# Altium schematic sheet SchemaCollier2016.SchDoc
size A4
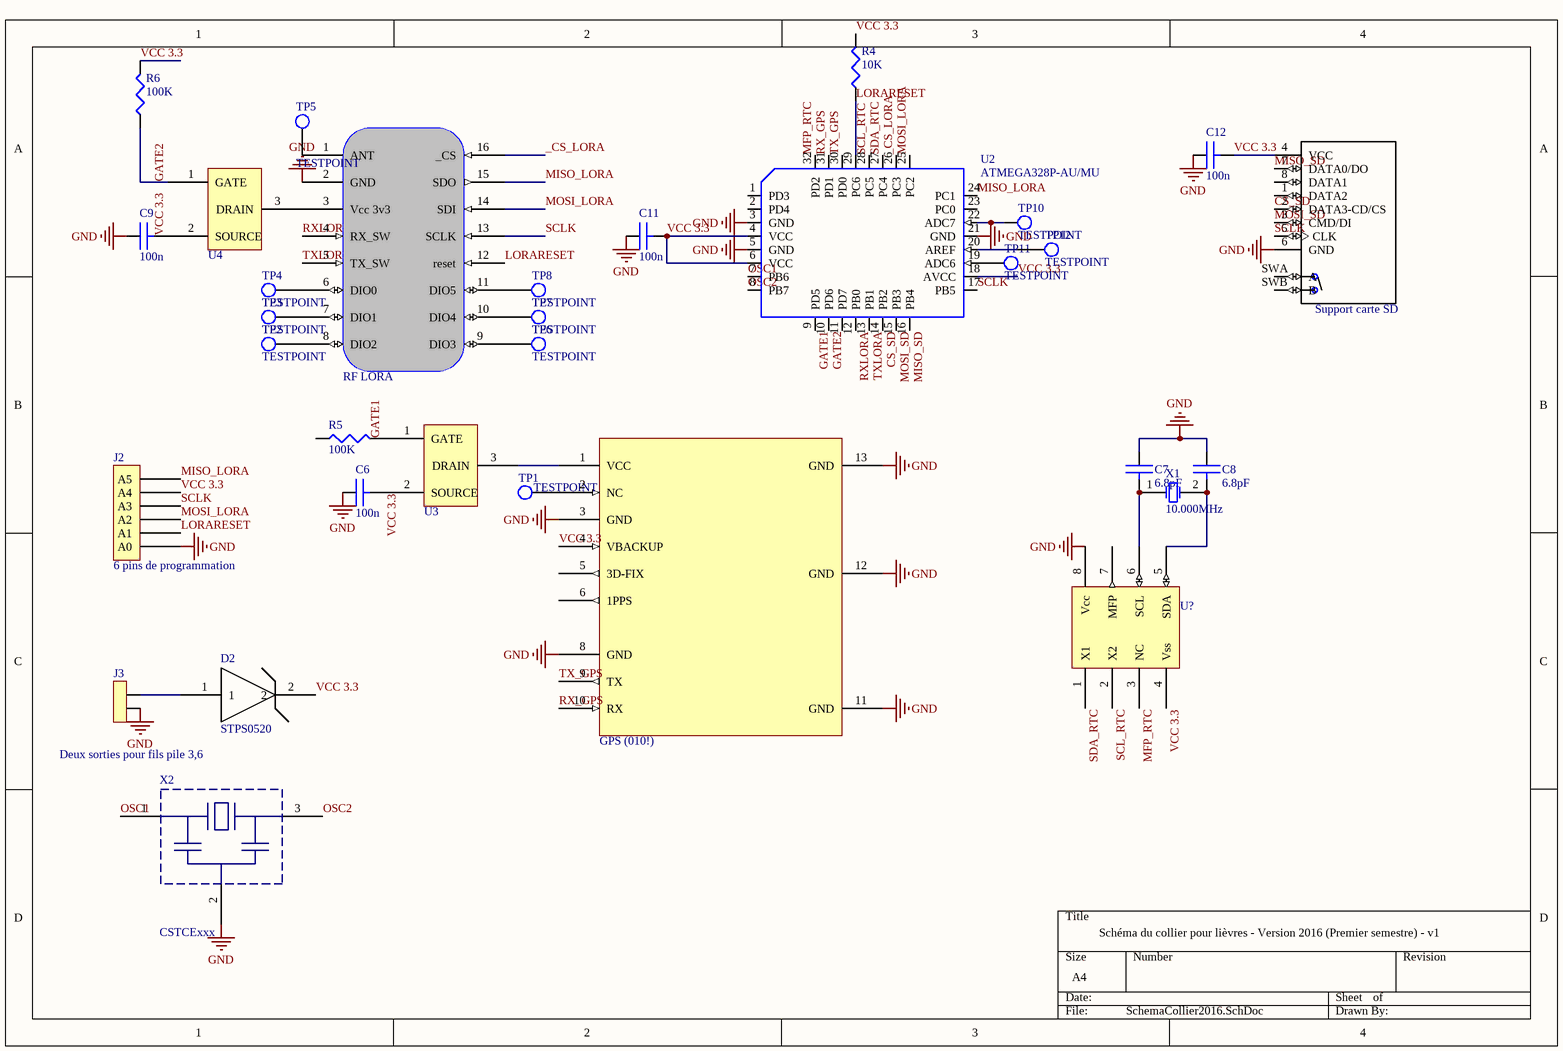
[diagram p0: SchemaCollier2016.SchDoc]

## Parts
C6  value 100n  [0805]  (hidden comment: CAP)
C7  value 6.8pF  [0603]  (hidden comment: CAP)
C8  value 6.8pF  [0603]  (hidden comment: CAP)
C9  value 100n  [0805]  (hidden comment: CAP)
C11  value 100n  [0805]  (hidden comment: CAP)
C12  value 100n  [0805]  (hidden comment: CAP)
D2  STPS0520  [PCBComponent_1]
GPS_(010!)  FGPMMOPA6H  [FGPMMOPA6H]  (value not drawn)
J2  6 pins de programmation  [arduino6]
J3  Deux sorties pour fils pile 3,6  [AMP_2]
R4  value 10K  [0805]  (hidden comment: RES)
R5  value 100K  [0805]  (hidden comment: RES)
R6  value 100K  [0805]  (hidden comment: RES)
RF_LORA  RF-LORA-868-SO  [RF-LORA-868-SO]  (value not drawn)
SD  DM3AT-SF-PEJM5  [HRS_DM3AT-SF-PEJM5_DM3AT-SF-PEJM5(Primary)]  (value not drawn)
TP1  TESTPOINT  [testpoint3]
TP2  TESTPOINT  [mini_testpoint]
TP3  TESTPOINT  [mini_testpoint]
TP4  TESTPOINT  [mini_testpoint]
TP5  TESTPOINT  [mini_testpoint]
TP6  TESTPOINT  [mini_testpoint]
TP7  TESTPOINT  [mini_testpoint]
TP8  TESTPOINT  [mini_testpoint]
TP10  TESTPOINT  [mini_testpoint]
TP11  TESTPOINT  [mini_testpoint]
TP12  TESTPOINT  [mini_testpoint]
U2  ATMEGA328P-AU/MU  [LQFP32]
U3  MCH3333A  [PCBComponent_1]  (value not drawn)
U4  MCH3333A  [PCBComponent_1]  (value not drawn)
U?  MCP7940  [SO8]  (value not drawn)
X1  10.000MHz  [QTC3]
X2  CSTCExxx  [CSTCE_RES]

## Nets
GND: C6.1 C7.1 C8.1 C9.1 C11.1 C12.1 GPS_(010!).3(GND) GPS_(010!).8(GND) GPS_(010!).11(GND) GPS_(010!).12(GND) GPS_(010!).13(GND) J2.1(A0) J3.2 RF_LORA.2(GND) SD.6(GND) U2.3(GND) U2.5(GND) U2.21(GND) U?.8(Vcc) X2.2
_CS_LORA: RF_LORA.16(_CS) U2.26(PC3)
CS_SD: SD.2(DATA3-CD/CS) U2.14(PB2)
GATE1: R5.2 U2.9(PD5) U3.1(GATE)
GATE2: R6.1 U2.10(PD6) U4.1(GATE)
LORARESET: J2.2(A1) R4.1 RF_LORA.12(reset) U2.29(PC6)
MFP_RTC: U2.32(PD2) U?.3(NC)
MISO_LORA: J2.6(A5) RF_LORA.15(SDO) U2.24(PC1)
MISO_SD: SD.7(DATA0/DO) U2.16(PB4)
MOSI_LORA: J2.3(A2) RF_LORA.14(SDI) U2.25(PC2)
MOSI_SD: SD.3(CMD/DI) U2.15(PB3)
OSC1: U2.7(PB6) X2.1
OSC2: U2.8(PB7) X2.3
RX_GPS: GPS_(010!).10(RX) U2.31(PD1)
RXLORA: RF_LORA.4(RX_SW) U2.12(PB0)
SCL_RTC: U2.28(PC5) U?.2(X2)
SCLK: J2.4(A3) RF_LORA.13(SCLK) SD.5(CLK) U2.17(PB5)
SDA_RTC: U2.27(PC4) U?.1(X1)
TX_GPS: GPS_(010!).9(TX) U2.30(PD0)
TXLORA: RF_LORA.5(TX_SW) U2.13(PB1)
VCC 3.3: C6.2 C9.2 C11.2 C12.2 D2.2 GPS_(010!).4(VBACKUP) J2.5(A4) R4.2 R6.2 SD.4(VCC) U2.4(VCC) U2.6(VCC) U2.18(AVCC) U3.2(SOURCE) U4.2(SOURCE) U?.4(Vss)
NetC7_2: C7.2 U?.6(SCL) X1.1(OSC1)
NetC8_2: C8.2 U?.5(SDA) X1.2(OSC2)
NetD2_1: D2.1 J3.1
NetGPS_(010!)_1: GPS_(010!).1(VCC) U3.3(DRAIN)
NetGPS_(010!)_2: GPS_(010!).2(NC) TP1.1
NetRF_LORA_1: RF_LORA.1(ANT) TP5.1
NetRF_LORA_3: RF_LORA.3(Vcc_3v3) U4.3(DRAIN)
NetRF_LORA_6: RF_LORA.6(DIO0) TP4.1
NetRF_LORA_7: RF_LORA.7(DIO1) TP3.1
NetRF_LORA_8: RF_LORA.8(DIO2) TP2.1
NetRF_LORA_9: RF_LORA.9(DIO3) TP6.1
NetRF_LORA_10: RF_LORA.10(DIO4) TP7.1
NetRF_LORA_11: RF_LORA.11(DIO5) TP8.1
NetTP10_1: TP10.1 U2.22(ADC7)
NetTP11_1: TP11.1 U2.19(ADC6)
NetTP12_1: TP12.1 U2.20(AREF)

Not connected (* = marked no-connect by the designer): GPS_(010!) 5(3D-FIX) 6(1PPS); R5 1; SD 1(DATA2) 8(DATA1) SWA(A) SWB(B); U2 1(PD3) 2(PD4) 11(PD7) 23(PC0); U? 7(MFP)

## Notes on the sheet
- (near SD) Support carte SD
- Schéma du collier pour lièvres - Version 2016 (Premier semestre) - v1

## Library data of the parts
C6-C9 C11 C12 = CAP: capacité non polarisée
J2 = arduinorev3_analog_in
J3 = POWER2: connecteur alim 2 pôles
R4-R6 = RES: resistance
SD = DM3AT-SF-PEJM5: DM3 Series 8 Position Right Angle SMT Push Push Ejection MicroSD Card Connector; MF: Hirose; Price: 1.92 USD; MP: DM3AT-SF-PEJM5; Availability: Good; Package: None; Value: *
X1 = XTAL: Quartz; Manufacturer: Generic Components; Class I: Oscillator; Class II: Crystal Oscillator; Published: 8-Jun-2000; Revision: July-2002: Re-released for DXP Platform.; Publisher: Altium Limited
X2 = CSTCE_XXXX: Murata CSTCE resonators series